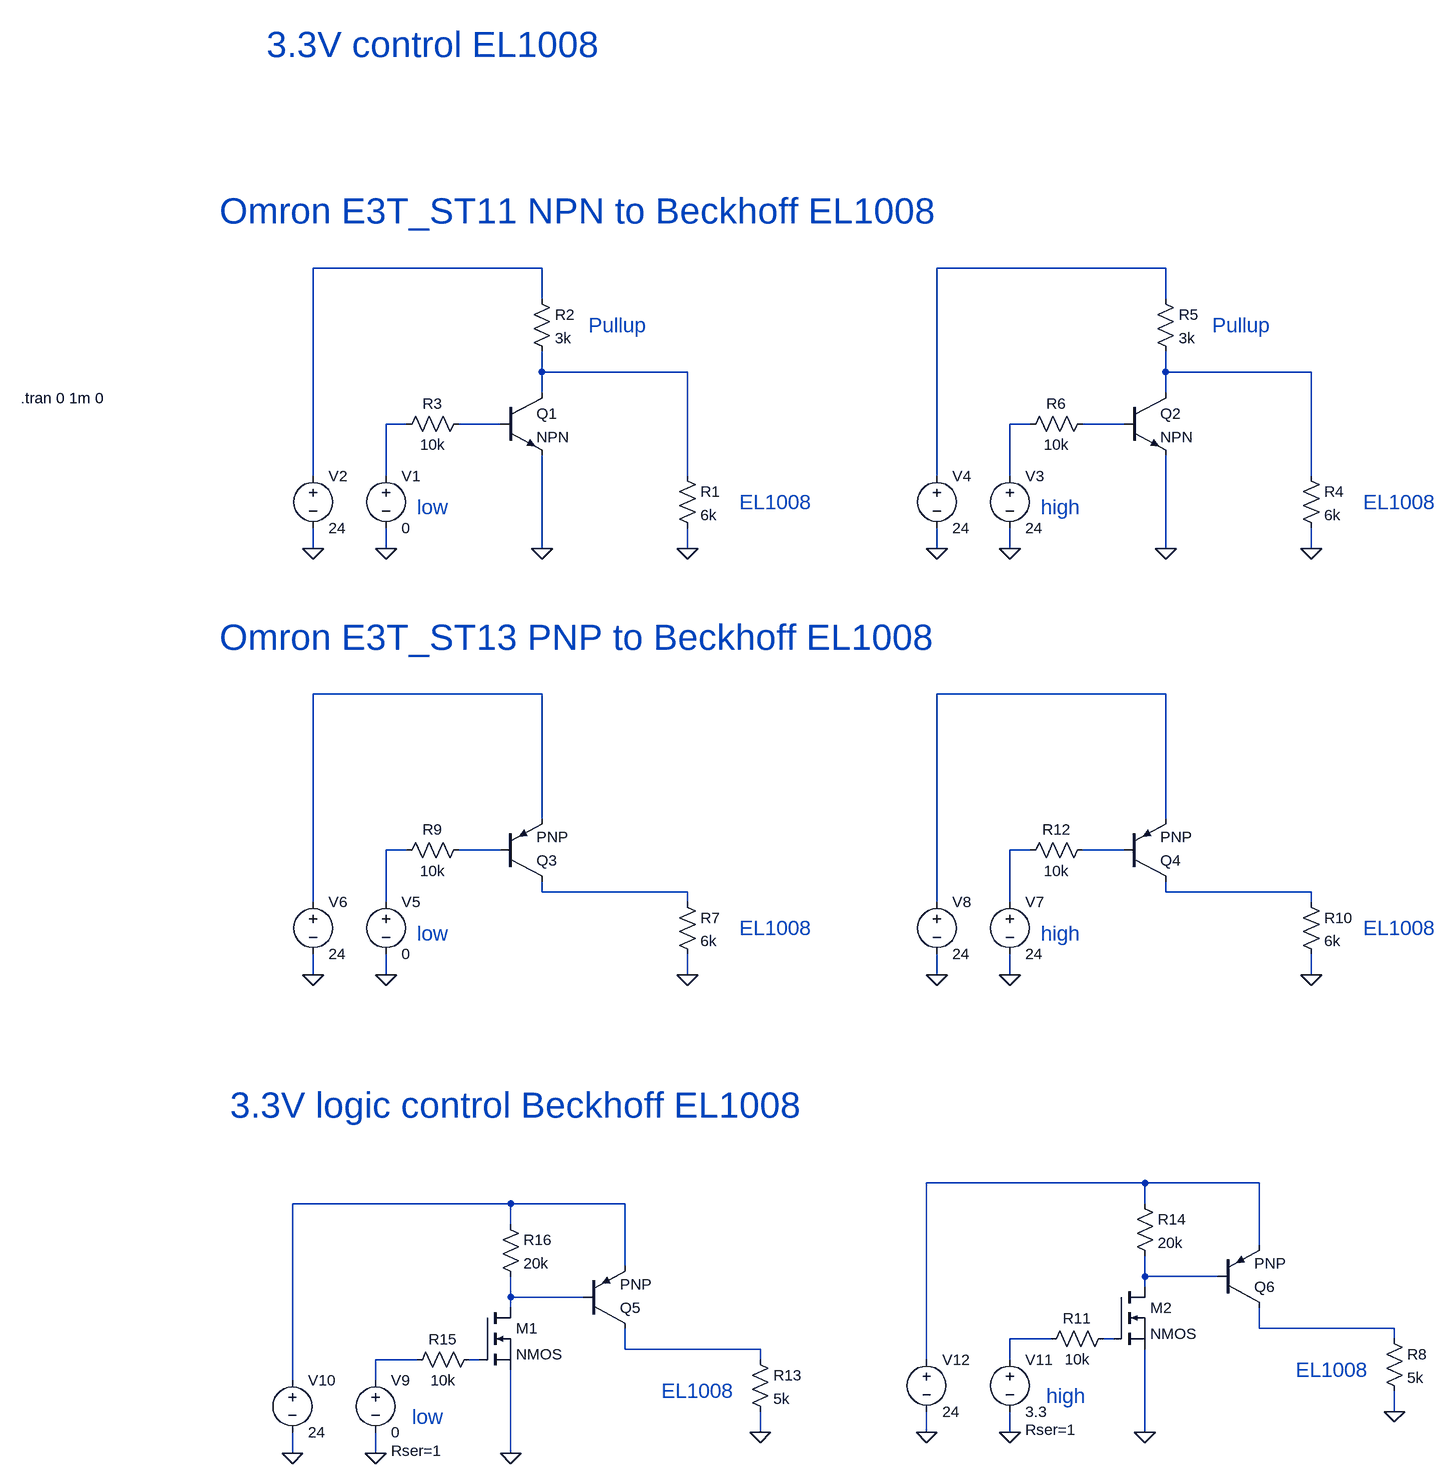
[diagram p0: schematic 3V3_control_24V_EL1008.asc]
3V3_control_24V_EL1008.asc, the LTspice schematic file:
Version 4
SHEET 1 1708 1884
WIRE 240 -176 -112 -176
WIRE 1200 -176 848 -176
WIRE 240 -128 240 -176
WIRE 1200 -128 1200 -176
WIRE 240 -16 240 -48
WIRE 464 -16 240 -16
WIRE 1200 -16 1200 -48
WIRE 1424 -16 1200 -16
WIRE 240 16 240 -16
WIRE 1200 16 1200 -16
WIRE 32 64 0 64
WIRE 176 64 112 64
WIRE 992 64 960 64
WIRE 1136 64 1072 64
WIRE -112 144 -112 -176
WIRE 0 144 0 64
WIRE 464 144 464 -16
WIRE 848 144 848 -176
WIRE 960 144 960 64
WIRE 1424 144 1424 -16
WIRE -112 256 -112 224
WIRE 0 256 0 224
WIRE 240 256 240 112
WIRE 464 256 464 224
WIRE 848 256 848 224
WIRE 960 256 960 224
WIRE 1200 256 1200 112
WIRE 1424 256 1424 224
WIRE 240 480 -112 480
WIRE 1200 480 848 480
WIRE 240 672 240 480
WIRE 1200 672 1200 480
WIRE 32 720 0 720
WIRE 176 720 112 720
WIRE 992 720 960 720
WIRE 1136 720 1072 720
WIRE 240 784 240 768
WIRE 464 784 240 784
WIRE 1200 784 1200 768
WIRE 1424 784 1200 784
WIRE -112 800 -112 480
WIRE 0 800 0 720
WIRE 464 800 464 784
WIRE 848 800 848 480
WIRE 960 800 960 720
WIRE 1424 800 1424 784
WIRE -112 912 -112 880
WIRE 0 912 0 880
WIRE 464 912 464 880
WIRE 848 912 848 880
WIRE 960 912 960 880
WIRE 1424 912 1424 880
WIRE 1168 1232 832 1232
WIRE 1344 1232 1168 1232
WIRE 192 1264 -144 1264
WIRE 368 1264 192 1264
WIRE 1168 1264 1168 1232
WIRE 192 1296 192 1264
WIRE 1344 1328 1344 1232
WIRE 368 1360 368 1264
WIRE 1168 1376 1168 1344
WIRE 1280 1376 1168 1376
WIRE 1168 1392 1168 1376
WIRE 192 1408 192 1376
WIRE 304 1408 192 1408
WIRE 192 1424 192 1408
WIRE 1344 1456 1344 1424
WIRE 1552 1456 1344 1456
WIRE 1024 1472 960 1472
WIRE 1120 1472 1104 1472
WIRE 1552 1472 1552 1456
WIRE 368 1488 368 1456
WIRE 576 1488 368 1488
WIRE 48 1504 -16 1504
WIRE 144 1504 128 1504
WIRE 576 1504 576 1488
WIRE 832 1504 832 1232
WIRE 960 1504 960 1472
WIRE -144 1536 -144 1264
WIRE -16 1536 -16 1504
WIRE 1552 1584 1552 1552
WIRE 576 1616 576 1584
WIRE 832 1616 832 1584
WIRE 960 1616 960 1584
WIRE 1168 1616 1168 1488
WIRE -144 1648 -144 1616
WIRE -16 1648 -16 1616
WIRE 192 1648 192 1520
FLAG 0 256 0
FLAG 464 256 0
FLAG -112 256 0
FLAG 240 256 0
FLAG -16 1648 0
FLAG 576 1616 0
FLAG -144 1648 0
FLAG 192 1648 0
FLAG 960 256 0
FLAG 1424 256 0
FLAG 848 256 0
FLAG 1200 256 0
FLAG 0 912 0
FLAG 464 912 0
FLAG -112 912 0
FLAG 960 912 0
FLAG 1424 912 0
FLAG 848 912 0
FLAG 960 1616 0
FLAG 1552 1584 0
FLAG 832 1616 0
FLAG 1168 1616 0
SYMBOL voltage 0 128 R0
WINDOW 123 0 0 Left 0
WINDOW 39 0 0 Left 0
SYMATTR InstName V1
SYMATTR Value 0
SYMBOL npn 176 16 R0
SYMATTR InstName Q1
SYMBOL res 448 128 R0
SYMATTR InstName R1
SYMATTR Value 6k
SYMBOL res 224 -144 R0
SYMATTR InstName R2
SYMATTR Value 3k
SYMBOL voltage -112 128 R0
WINDOW 123 0 0 Left 0
WINDOW 39 0 0 Left 0
SYMATTR InstName V2
SYMATTR Value 24
SYMBOL res 128 48 R90
WINDOW 0 0 56 VBottom 2
WINDOW 3 32 56 VTop 2
SYMATTR InstName R3
SYMATTR Value 10k
SYMBOL voltage -16 1520 R0
WINDOW 123 0 0 Left 0
WINDOW 39 24 124 Left 2
SYMATTR InstName V9
SYMATTR Value 0
SYMATTR SpiceLine Rser=1
SYMBOL res 560 1488 R0
SYMATTR InstName R13
SYMATTR Value 5k
SYMBOL voltage -144 1520 R0
WINDOW 123 0 0 Left 0
WINDOW 39 0 0 Left 0
SYMATTR InstName V10
SYMATTR Value 24
SYMBOL res 144 1488 R90
WINDOW 0 0 56 VBottom 2
WINDOW 3 32 56 VTop 2
SYMATTR InstName R15
SYMATTR Value 10k
SYMBOL pnp 304 1456 M180
SYMATTR InstName Q5
SYMBOL nmos 144 1424 R0
SYMATTR InstName M1
SYMBOL res 176 1280 R0
SYMATTR InstName R16
SYMATTR Value 20k
SYMBOL voltage 960 128 R0
WINDOW 123 0 0 Left 0
WINDOW 39 0 0 Left 0
SYMATTR InstName V3
SYMATTR Value 24
SYMBOL npn 1136 16 R0
SYMATTR InstName Q2
SYMBOL res 1408 128 R0
SYMATTR InstName R4
SYMATTR Value 6k
SYMBOL res 1184 -144 R0
SYMATTR InstName R5
SYMATTR Value 3k
SYMBOL voltage 848 128 R0
WINDOW 123 0 0 Left 0
WINDOW 39 0 0 Left 0
SYMATTR InstName V4
SYMATTR Value 24
SYMBOL res 1088 48 R90
WINDOW 0 0 56 VBottom 2
WINDOW 3 32 56 VTop 2
SYMATTR InstName R6
SYMATTR Value 10k
SYMBOL voltage 0 784 R0
WINDOW 123 0 0 Left 0
WINDOW 39 0 0 Left 0
SYMATTR InstName V5
SYMATTR Value 0
SYMBOL res 448 784 R0
SYMATTR InstName R7
SYMATTR Value 6k
SYMBOL voltage -112 784 R0
WINDOW 123 0 0 Left 0
WINDOW 39 0 0 Left 0
SYMATTR InstName V6
SYMATTR Value 24
SYMBOL res 128 704 R90
WINDOW 0 0 56 VBottom 2
WINDOW 3 32 56 VTop 2
SYMATTR InstName R9
SYMATTR Value 10k
SYMBOL pnp 176 768 M180
SYMATTR InstName Q3
SYMBOL voltage 960 784 R0
WINDOW 123 0 0 Left 0
WINDOW 39 0 0 Left 0
SYMATTR InstName V7
SYMATTR Value 24
SYMBOL res 1408 784 R0
SYMATTR InstName R10
SYMATTR Value 6k
SYMBOL voltage 848 784 R0
WINDOW 123 0 0 Left 0
WINDOW 39 0 0 Left 0
SYMATTR InstName V8
SYMATTR Value 24
SYMBOL res 1088 704 R90
WINDOW 0 0 56 VBottom 2
WINDOW 3 32 56 VTop 2
SYMATTR InstName R12
SYMATTR Value 10k
SYMBOL pnp 1136 768 M180
SYMATTR InstName Q4
SYMBOL voltage 960 1488 R0
WINDOW 123 0 0 Left 0
WINDOW 39 24 124 Left 2
SYMATTR InstName V11
SYMATTR Value 3.3
SYMATTR SpiceLine Rser=1
SYMBOL res 1536 1456 R0
SYMATTR InstName R8
SYMATTR Value 5k
SYMBOL voltage 832 1488 R0
WINDOW 123 0 0 Left 0
WINDOW 39 0 0 Left 0
SYMATTR InstName V12
SYMATTR Value 24
SYMBOL res 1120 1456 R90
WINDOW 0 0 56 VBottom 2
WINDOW 3 32 56 VTop 2
SYMATTR InstName R11
SYMATTR Value 10k
SYMBOL pnp 1280 1424 M180
SYMATTR InstName Q6
SYMBOL nmos 1120 1392 R0
SYMATTR InstName M2
SYMBOL res 1152 1248 R0
SYMATTR InstName R14
SYMATTR Value 20k
TEXT -562 24 Left 2 !.tran 0 1m 0
TEXT -184 -520 Left 5 ;3.3V control EL1008
TEXT -240 1112 Left 5 ;3.3V logic control Beckhoff EL1008
TEXT -256 -264 Left 5 ;Omron E3T_ST11 NPN to Beckhoff EL1008
TEXT 312 -88 Left 3 ;Pullup
TEXT 544 184 Left 3 ;EL1008
TEXT 48 192 Left 3 ;low
TEXT 1272 -88 Left 3 ;Pullup
TEXT 1504 184 Left 3 ;EL1008
TEXT 1008 192 Left 3 ;high
TEXT -256 392 Left 5 ;Omron E3T_ST13 PNP to Beckhoff EL1008
TEXT 544 840 Left 3 ;EL1008
TEXT 48 848 Left 3 ;low
TEXT 1504 840 Left 3 ;EL1008
TEXT 1008 848 Left 3 ;high
TEXT 40 1592 Left 3 ;low
TEXT 424 1552 Left 3 ;EL1008
TEXT 1016 1560 Left 3 ;high
TEXT 1400 1520 Left 3 ;EL1008

The netlist it stands for:
* 3V3_control_24V_EL1008.asc
V1 N005 0 0
Q1 N003 N006 0 0 NPN
R1 N003 0 6k
R2 N001 N003 3k
V2 N001 0 24
R3 N006 N005 10k
V9 N025 0 0 Rser=1
R13 N024 0 5k
V10 N018 0 24
R15 N026 N025 10k
Q5 N024 N020 N018 0 PNP
M1 N020 N026 0 0 NMOS
R16 N018 N020 20k
V3 N007 0 24
Q2 N004 N008 0 0 NPN
R4 N004 0 6k
R5 N002 N004 3k
V4 N002 0 24
R6 N008 N007 10k
V5 N011 0 0
R7 N015 0 6k
V6 N009 0 24
R9 N012 N011 10k
Q3 N015 N012 N009 0 PNP
V7 N013 0 24
R10 N016 0 6k
V8 N010 0 24
R12 N014 N013 10k
Q4 N016 N014 N010 0 PNP
V11 N022 0 3.3 Rser=1
R8 N021 0 5k
V12 N017 0 24
R11 N023 N022 10k
Q6 N021 N019 N017 0 PNP
M2 N019 N023 0 0 NMOS
R14 N017 N019 20k
.model NPN NPN
.model PNP PNP
.lib standard.bjt
.model NMOS NMOS
.model PMOS PMOS
.lib standard.mos
.tran 0 1m 0
* 3.3V control EL1008
* 3.3V logic control Beckhoff EL1008
* Omron E3T_ST11 NPN to Beckhoff EL1008
* Pullup
* EL1008
* low
* Pullup
* EL1008
* high
* Omron E3T_ST13 PNP to Beckhoff EL1008
* EL1008
* low
* EL1008
* high
* low
* EL1008
* high
* EL1008
.backanno
.end